# Altium schematic sheet Daughterboard.SchDoc
size A4; SheetNumber: 1; SheetTotal: 1
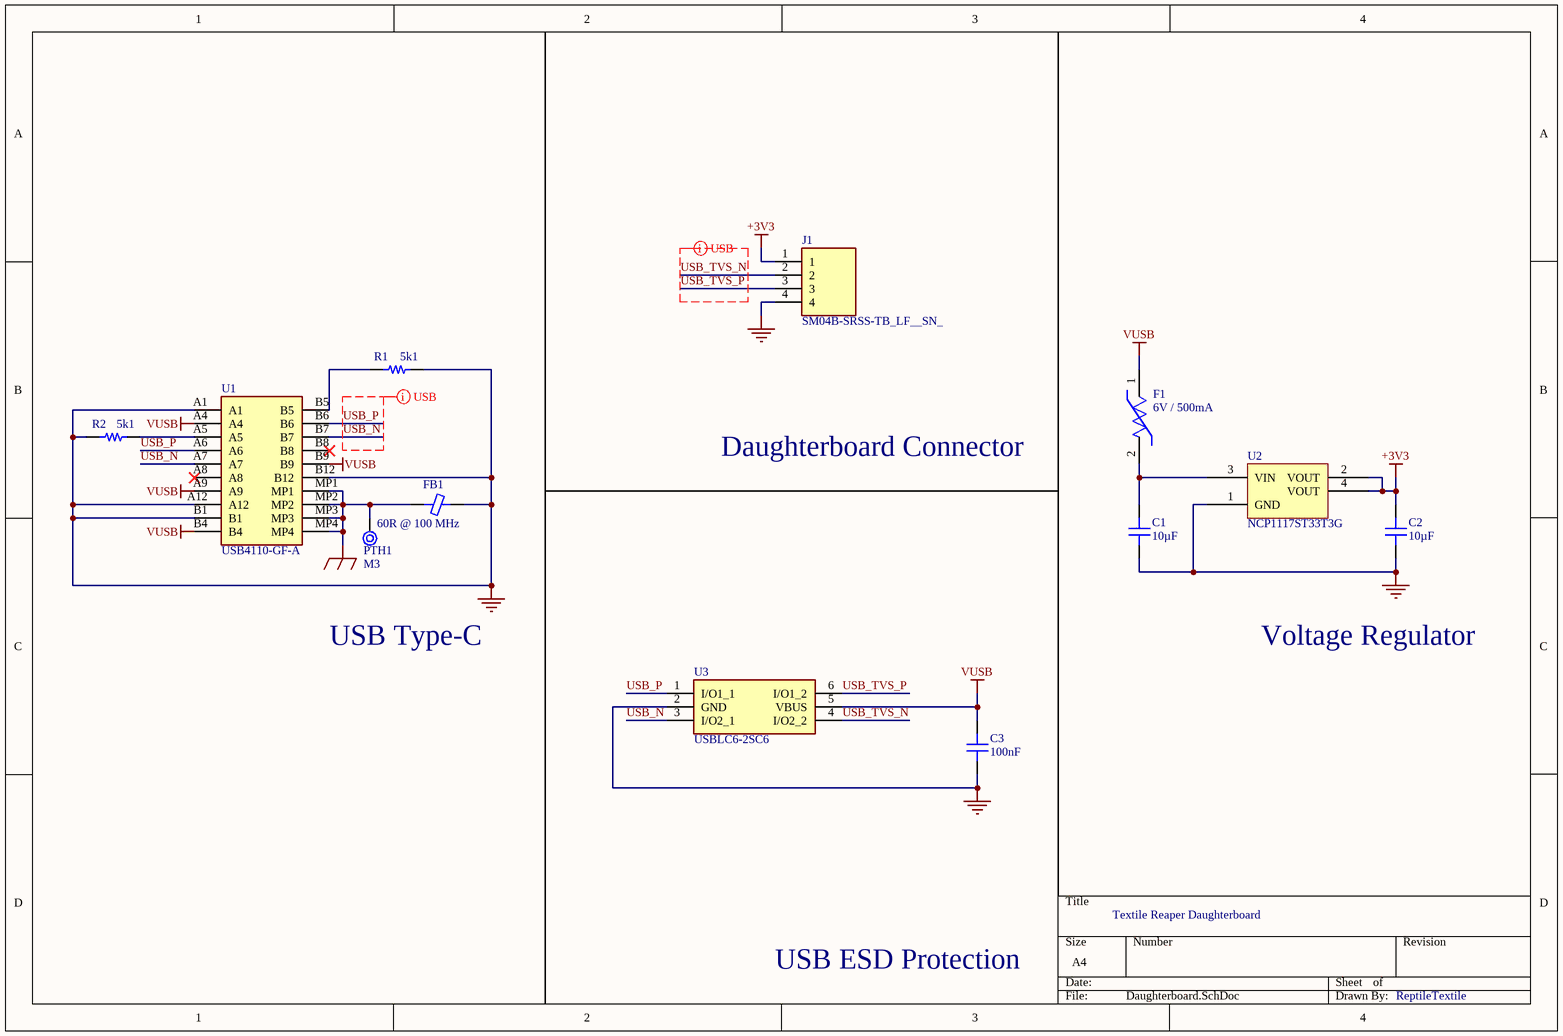
[diagram p0: Daughterboard.SchDoc]

## Parts
C1  10µF  [CAP 0402_1005]
C2  10µF  [CAP 0402_1005]
C3  100nF  [CAP 0402_1005]
F1  6V / 500mA  [FP-MF-PSMF-MFG]
FB1  60R @ 100 MHz  [FER 0603_1608]
J1  SM04B-SRSS-TB_LF__SN_  [SM04B-SRSS-TB(LFSN)]
PTH1  M3  [SCREW_HOLE]
R1  5k1  [RES 0402_1005]
R2  5k1  [RES 0402_1005]
U1  USB4110-GF-A  [USB4110GFA]
U2  NCP1117ST33T3G  [ON SEMI SOT-223 ST(318H)]
U3  USBLC6-2SC6  [SOT95P280X145-6N]

## Nets
+3V3: C2.2 J1.1 U2.2(VOUT) U2.4(VOUT)
CHASIS: FB1.1 PTH1.0 U1.MP1 U1.MP2 U1.MP3 U1.MP4
GND: C1.1 C2.1 C3.1 FB1.2 J1.4 R1.2 R2.1 U1.A1 U1.A12 U1.B1 U1.B12 U2.1(GND) U3.2(GND)
VUSB: C3.2 F1.1 U1.A4 U1.A9 U1.B4 U1.B9 U3.5(VBUS)
USB_N: U1.A7 U1.B7 U3.3(I/O2_1)
USB_P: U1.A6 U1.B6 U3.1(I/O1_1)
USB_TVS_N: J1.2 U3.4(I/O2_2)
USB_TVS_P: J1.3 U3.6(I/O1_2)
NetC1_2: C1.2 F1.2 U2.3(VIN)
NetR1_1: R1.1 U1.B5
NetR2_2: R2.2 U1.A5

Not connected (* = marked no-connect by the designer): U1 A8* B8*

## Layout directives
differential pair; differential pair class USB_Lines; net class USB: USB_N, USB_P
differential pair; net class USB_TVS; differential pair class USB_Lines: USB_TVS_N, USB_TVS_P

## Notes on the sheet
- Daughterboard Connector
- USB Type-C
- Voltage Regulator
- Textile Reaper Daughterboard
- USB ESD Protection
- ReptileTextile

## Library data of the parts
C1 C2 = CL05A106MP8NUB8: CAP CER 10UF 10V X5R 0402; manufacturer: Samsung Electro-Mechanics; Tolerance: ±20%; Part Number: CL05A106MP8NUB8; Value: 10µF; Applications: General Purpose; Capacitance: 10 µF; componentlink1description: Datasheet; componentlink1url: http://www.samsungsem.com/kr/support/product-search/mlcc/CL05A106MP8NUB8.jsp; componentlink2description: DigiKey Link; componentlink2url: https://www.digikey.com/en/products/detail/samsung-electro-mechanics/CL05A106MP8NUB8/5961314; Device Package: 0402 (1005 Metric); lastupdated: 11.08.2022 08:52:23; Lifecycle Status: Active; Minimum Order: 1; Mounting Type: Surface Mount, MLCC; Operating Temperature: -55°C ~ 85°C; Package / Case: 0402 (1005 Metric); packaging: TapeAndReel; partid: 1758; Part Status: Active; price: 0.07; series: CL; Size / Dimension: 0.039" L x 0.020" W (1.00mm x 0.50mm); Supplier 1: DigiKey; Supplier Part Number 1: 1276-6830-1-ND; Temperature Coefficient: X5R; Thickness (Max): 0.035" (0.90mm); Voltage - Rated: 10V
C3 = C0402C104K4RECAUTO: CAP CER 0402 0.1UF 16V X7R 10%; manufacturer: KEMET; Capacitance: 0.1 µF; Part Number: C0402C104K4RECAUTO; Value: 100nF; Applications: Automotive, ESD Protection; componentlink1description: Datasheet; componentlink1url: https://api.kemet.com/component-edge/download/datasheet/C0402C104K4RECAUTO.pdf; componentlink2description: DigiKey Link; componentlink2url: https://www.digikey.com/en/products/detail/kemet/C0402C104K4RECAUTO/8563695; Device Package: 0402 (1005 Metric); lastupdated: 11.08.2022 08:52:24; Lifecycle Status: Active; Minimum Order: 1; Mounting Type: Surface Mount, MLCC; Operating Temperature: -55°C ~ 125°C; Package / Case: 0402 (1005 Metric); packaging: TapeAndReel; partid: 1731; Part Status: Active; price: 0.02; Ratings: AEC-Q200; series: ESD SMD Auto X7R; Size / Dimension: 0.039" L x 0.020" W (1.00mm x 0.50mm); Supplier 1: DigiKey; Supplier Part Number 1: 399-17167-1-ND; Temperature Coefficient: X7R; Thickness (Max): 0.022" (0.55mm); Tolerance: ±10%; Voltage - Rated: 16V
F1 = CMP-07400-000013-1: PTC RESET FUSE 6V 500MA 0805; Manufacturer Part Number: MF-PSMF050X-2; Manufacturer: Bourns Inc.; Trip Current: 1A; Trip Time: 0.1s; Value: 0.15-0.9Ω; Hold Current: 0.5A; Current Rating: 40A; Category: Fuse; Temperature: -40°C to +85°C; ComponentLink2Description: Datasheet; Temperature Range High: +85°C; Package: MF-PSMF; Device Class L1: Circuit Protection; Lead Free: Yes; ComponentLink2URL: https://www.bourns.com/docs/product-datasheets/mfpsmf.pdf?sfvrsn=9c05cafe_24; Ambient Temperature Range Low: -40°C; Mouser Description: Resettable Fuses - PPTC .50A 6V 0.15ohm Hold .5 Trip 1; Resistance: 0.15-0.9Ω; Automotive: Yes; Ambient Temperature Range High: +85°C; Device Class L2: PTC Resettable Fuses; Temperature Range Low: -40°C; Device Class L3: unset; Octopart: https://octopart.com/mf-psmf050x-2-bourns-7483438; Digikey Description: PTC RESET FUSE 6V 500MA 0805; Height: 0.85mm; RoHS: TRUE; Voltage Rating: 6V
FB1 = FBTH1608HE600-T: FERRITE BEAD,HIGH CURRENT, 0603; Manufacturer: Taiyo Yuden; Current Rating (Max): 2.25A; DC Resistance (DCR) (Max): 25mOhm; Filter Type: Power Line; Impedance @ Frequency: 60 Ohms @ 100 MHz; Number of Lines: 1; Part Number: FBTH1608HE600-T; ComponentLink1Description: Datasheet; ComponentLink1URL: https://ds.yuden.co.jp/TYCOMPAS/ut/detail?pn=FBTH1608HE600-T&u=M; ComponentLink2Description: DigiKey Link; ComponentLink2URL: https://www.digikey.com/en/products/detail/taiyo-yuden/FBTH1608HE600-T/10324933; Device Package: 0603 (1608 Metric); Height (Max): 0.037" (0.95mm); LastUpdated: 11.08.2022 09:33:59; Lifecycle Status: Active; Minimum Order: 1; Mounting Type: Surface Mount; Operating Temperature: -40°C ~ 150°C; Package / Case: 0603 (1608 Metric); Packaging: TapeAndReel; PartId: 706; Part Status: Active; Price: 0.09; Ratings: AEC-Q200; Series: FB; Size / Dimension: 0.063" L x 0.031" W (1.60mm x 0.80mm); Supplier 1: DigiKey; Supplier Part Number 1: 587-6594-1-ND; Value: 60R @ 100 MHz
J1 = SM04B-SRSS-TB_LF__SN_: Connector; Manufacturer_Name: JST (JAPAN SOLDERLESS TERMINALS); Manufacturer_Part_Number: SM04B-SRSS-TB(LF)(SN); Datasheet Link: http://www.jst-mfg.com/product/pdf/eng/eSH.pdf; Arrow Part Number: SM04B-SRSS-TB(LF)(SN); Arrow Price/Stock: https://www.arrow.com/en/products/sm04b-srss-tb-lf-sn/jst-manufacturing
PTH1 = Hole
R1 R2 = RC0402JR-075K1L: RES 5.1K OHM 5% 1/16W 0402; Manufacturer: Yageo; Power (Watts): 0.063W, 1/16W; Resistance: 5.1 kOhms; Temperature Coefficient: ±100ppm/°C; Part Number: RC0402JR-075K1L; Value: 5k1; ComponentLink1Description: Datasheet; ComponentLink1URL: https://www.yageo.com/upload/media/product/productsearch/datasheet/rchip/PYu-RC_Group_51_RoHS_L_10.pdf; ComponentLink2Description: DigiKey Link; ComponentLink2URL: https://www.digikey.com/en/products/detail/yageo/RC0402JR-075K1L/726487; Composition: Thick Film; Device Package: 0402 (1005 Metric); Features: Moisture Resistant; Height - Seated (Max): 0.016" (0.40mm); LastUpdated: 11.08.2022 09:08:05; Lifecycle Status: Active; Minimum Order: 1; Number of Terminations: 2; Operating Temperature: -55°C ~ 155°C; Package / Case: 0402 (1005 Metric); Packaging: CutTape; PartId: 4786; Part Status: Active; Price: 0.01; Series: RC_L; Size / Dimension: 0.039" L x 0.020" W (1.00mm x 0.50mm); Supplier 1: DigiKey; Supplier Part Number 1: 311-5.1KJRCT-ND; Supplier Device Package: 0402; Tolerance: ±5%
U1 = USB4110-GF-A: Connector; Manufacturer_Name: GCT (GLOBAL CONNECTOR TECHNOLOGY); Datasheet Link: https://gct.co/files/drawings/usb4110.pdf; Height: 3.26mm; Manufacturer_Part_Number: USB4110-GF-A; Mouser Part Number: 640-USB4110-GF-A; Mouser Price/Stock: https://www.mouser.co.uk/ProductDetail/GCT/USB4110-GF-A?qs=KUoIvG%2F9IlYiZvIXQjyJeA%3D%3D
U2 = NCP1117ST33T3G: IC REG LINEAR 3.3V 1A SOT223; Manufacturer: ON Semiconductor; Current - Quiescent (Iq): 10mA; Number of Regulators: 1; Output Configuration: Positive; Output Type: Fixed; Protection Features: Over Current, Over Temperature; PSRR: 64dB (120Hz); Voltage Dropout (Max): 1.2V @ 800mA; Voltage - Input (Max): 20V; Part Number: NCP1117ST33T3G; ComponentLink1Description: Datasheet; ComponentLink1URL: https://www.onsemi.com/pub/Collateral/NCP1117-D.PDF; ComponentLink2Description: DigiKey Link; ComponentLink2URL: http://digikey.com/product-detail/en/on-semiconductor/NCP1117ST33T3G/NCP1117ST33T3GOSCT-ND/660708; Current - Output: 1A; LastUpdated: 9.08.2022 12:47:35; Lifecycle Status: Active; Minimum Order: 1; Mounting Type: Surface Mount; Package / Case: TO-261-4, TO-261AA; Packaging: TapeAndReel; Part Status: Active; Price: 0.15; Series: -; Supplier 1: DigiKey; Supplier Part Number 1: NCP1117ST33T3GOSCT-ND; Supplier Device Package: SOT-223; Voltage - Output (Min/Fixed): 3.3V
U3 = USBLC6-2SC6: Integrated Circuit; Manufacturer_Name: STMicroelectronics; Datasheet Link: http://www.st.com/st-web-ui/static/active/en/resource/technical/document/datasheet/CD00050750.pdf; Height: 1.45mm; Manufacturer_Part_Number: USBLC6-2SC6; Mouser Part Number: 511-USBLC6-2SC6; Mouser Price/Stock: https://www.mouser.co.uk/ProductDetail/STMicroelectronics/USBLC6-2SC6?qs=po45yt2pPpu%2FhNIlwQdTlg%3D%3D; Arrow Part Number: USBLC6-2SC6; Arrow Price/Stock: https://www.arrow.com/en/products/usblc6-2sc6/stmicroelectronics?region=nac